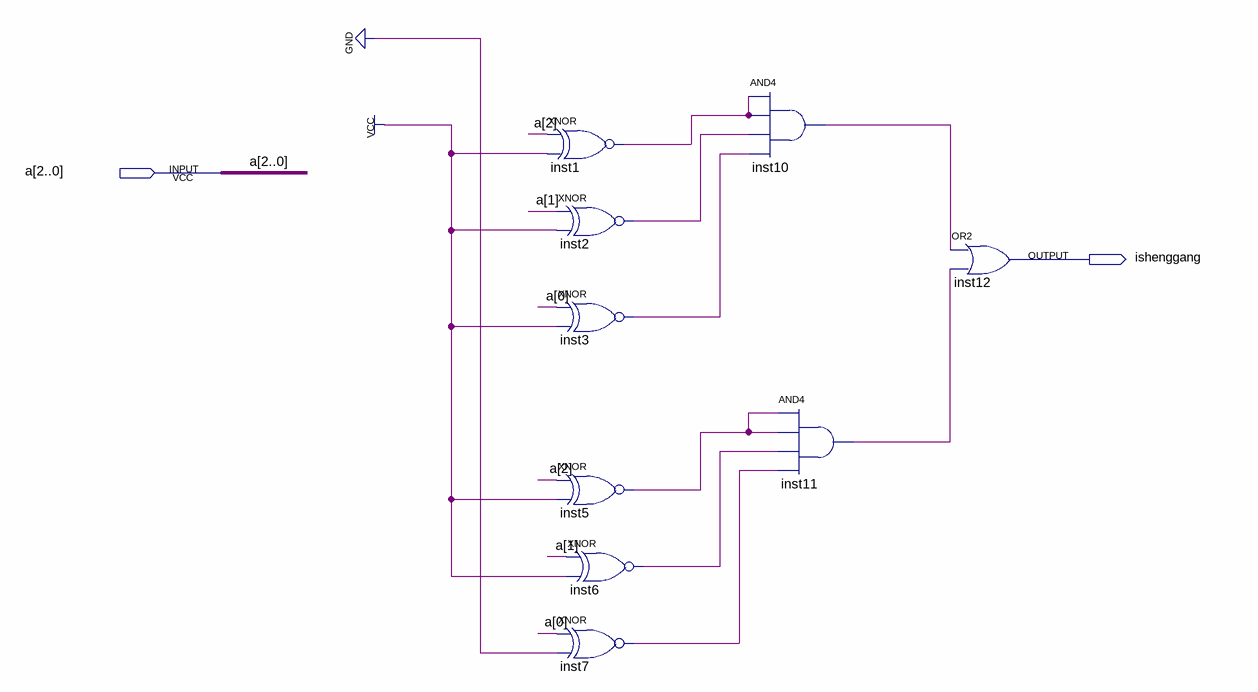
[diagram p0: schematic sheet]
// Quartus schematic ishenggang.bdf as structural Verilog: 9 symbols, 2 pins
module ishenggang (
  input  [2:0] a,
  output ishenggang
);

  wire inst1_out, inst2_out, inst3_out, inst5_out, inst6_out, inst7_out, inst10_out, inst11_out;

  xnor inst1 (inst1_out, a[2], 1'b1);
  xnor inst2 (inst2_out, a[1], 1'b1);
  xnor inst3 (inst3_out, a[0], 1'b1);
  xnor inst5 (inst5_out, a[2], 1'b1);
  xnor inst6 (inst6_out, a[1], 1'b1);
  xnor inst7 (inst7_out, a[0], 1'b0);
  and inst10 (inst10_out, inst1_out, inst1_out, inst2_out, inst3_out);
  and inst11 (inst11_out, inst5_out, inst5_out, inst6_out, inst7_out);
  or inst12 (ishenggang, inst10_out, inst11_out);
endmodule
